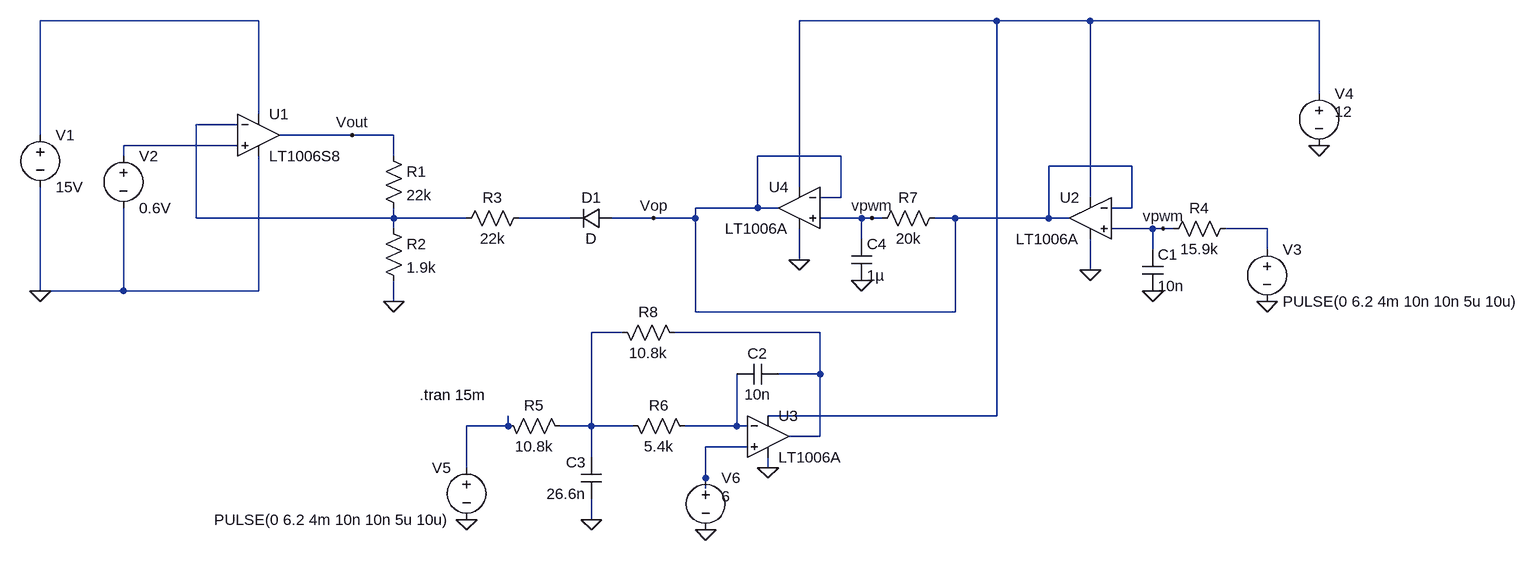
[diagram p0: schematic TPS56x21_buck_adjustable.asc]
TPS56x21_buck_adjustable.asc, the LTspice schematic file:
Version 4
SHEET 1 1580 784
WIRE -416 -32 -752 -32
WIRE 720 -32 416 -32
WIRE 864 -32 720 -32
WIRE 1216 -32 864 -32
WIRE 1216 80 1216 -32
WIRE -416 112 -416 -32
WIRE -448 128 -512 128
WIRE -752 144 -752 -32
WIRE -272 144 -384 144
WIRE -208 144 -272 144
WIRE -448 160 -624 160
WIRE -624 176 -624 160
WIRE -208 176 -208 144
WIRE 480 176 352 176
WIRE 928 192 800 192
WIRE 416 224 416 -32
WIRE 480 240 480 176
WIRE 480 240 448 240
WIRE 864 240 864 -32
WIRE 352 256 352 176
WIRE 352 256 256 256
WIRE 384 256 352 256
WIRE 928 256 928 192
WIRE 928 256 896 256
WIRE -512 272 -512 128
WIRE -208 272 -208 256
WIRE -208 272 -512 272
WIRE -96 272 -208 272
WIRE 64 272 -16 272
WIRE 192 272 128 272
WIRE 256 272 256 256
WIRE 256 272 192 272
WIRE 512 272 448 272
WIRE 528 272 512 272
WIRE 544 272 528 272
WIRE 656 272 624 272
WIRE 800 272 800 192
WIRE 800 272 656 272
WIRE 832 272 800 272
WIRE -208 288 -208 272
WIRE 960 288 896 288
WIRE 976 288 960 288
WIRE 992 288 976 288
WIRE 1136 288 1072 288
WIRE 512 304 512 272
WIRE 960 320 960 288
WIRE 1136 320 1136 288
WIRE 416 336 416 288
WIRE 864 352 864 304
WIRE -752 384 -752 224
WIRE -624 384 -624 256
WIRE -624 384 -752 384
WIRE -416 384 -416 176
WIRE -416 384 -624 384
WIRE -208 400 -208 368
WIRE 256 416 256 272
WIRE 656 416 656 272
WIRE 656 416 256 416
WIRE 144 448 96 448
WIRE 448 448 224 448
WIRE 448 512 448 448
WIRE 448 512 384 512
WIRE 720 576 720 -32
WIRE 720 576 368 576
WIRE -32 592 -32 576
WIRE -32 592 -96 592
WIRE 96 592 96 448
WIRE 96 592 48 592
WIRE 160 592 96 592
WIRE 320 592 320 512
WIRE 320 592 240 592
WIRE 336 592 320 592
WIRE 448 608 448 512
WIRE 448 608 400 608
WIRE 336 624 272 624
WIRE 96 640 96 592
WIRE -96 656 -96 592
WIRE 368 656 368 640
WIRE 272 672 272 624
WIRE 272 688 272 672
WIRE 96 736 96 704
FLAG -208 400 0
FLAG -752 384 0
FLAG 1136 400 0
FLAG -272 144 Vout
FLAG 864 352 0
FLAG 960 384 0
FLAG 976 288 vpwm
FLAG 192 272 Vop
FLAG 1216 160 0
FLAG -96 736 0
FLAG 368 656 0
FLAG 96 736 0
FLAG 416 336 0
FLAG 512 368 0
FLAG 528 272 vpwm
FLAG 272 752 0
SYMBOL voltage -752 128 R0
WINDOW 123 0 0 Left 2
WINDOW 39 0 0 Left 2
SYMATTR InstName V1
SYMATTR Value 15V
SYMBOL res -224 160 R0
SYMATTR InstName R1
SYMATTR Value 22k
SYMBOL res -224 272 R0
SYMATTR InstName R2
SYMATTR Value 1.9k
SYMBOL Opamps\\LT1006S8 -416 80 R0
SYMATTR InstName U1
SYMBOL voltage -624 160 R0
WINDOW 123 0 0 Left 2
WINDOW 39 0 0 Left 2
SYMATTR InstName V2
SYMATTR Value 0.6V
SYMBOL voltage 1136 304 R0
WINDOW 123 0 0 Left 2
WINDOW 39 0 0 Left 2
SYMATTR InstName V3
SYMATTR Value PULSE(0 6.2 4m 10n 10n 5u 10u)
SYMBOL res 0 256 R90
WINDOW 0 0 56 VBottom 2
WINDOW 3 32 56 VTop 2
SYMATTR InstName R3
SYMATTR Value 22k
SYMBOL diode 128 256 R90
WINDOW 0 0 32 VBottom 2
WINDOW 3 32 32 VTop 2
SYMATTR InstName D1
SYMBOL Opamps\\LT1006A 864 208 M0
SYMATTR InstName U2
SYMBOL cap 944 320 R0
SYMATTR InstName C1
SYMATTR Value 10n
SYMBOL res 1088 272 R90
WINDOW 0 0 56 VBottom 2
WINDOW 3 32 56 VTop 2
SYMATTR InstName R4
SYMATTR Value 15.9k
SYMBOL voltage 1216 64 R0
WINDOW 123 0 0 Left 2
WINDOW 39 0 0 Left 2
WINDOW 3 24 44 Left 2
SYMATTR Value 12
SYMATTR InstName V4
SYMBOL voltage -96 640 M0
WINDOW 123 0 0 Left 2
WINDOW 39 0 0 Left 2
SYMATTR InstName V5
SYMATTR Value PULSE(0 6.2 4m 10n 10n 5u 10u)
SYMBOL Opamps\\LT1006A 368 544 R0
SYMATTR InstName U3
SYMBOL cap 320 496 M90
WINDOW 0 0 32 VBottom 2
WINDOW 3 32 32 VTop 2
SYMATTR InstName C2
SYMATTR Value 10n
SYMBOL res -48 576 M90
WINDOW 0 0 56 VBottom 2
WINDOW 3 32 56 VTop 2
SYMATTR InstName R5
SYMATTR Value 10.8k
SYMBOL res 144 576 M90
WINDOW 0 0 56 VBottom 2
WINDOW 3 32 56 VTop 2
SYMATTR InstName R6
SYMATTR Value 5.4k
SYMBOL cap 112 640 M0
SYMATTR InstName C3
SYMATTR Value 26.6n
SYMBOL Opamps\\LT1006A 416 192 M0
SYMATTR InstName U4
SYMBOL cap 496 304 R0
SYMATTR InstName C4
SYMATTR Value 1µ
SYMBOL res 640 256 R90
WINDOW 0 0 56 VBottom 2
WINDOW 3 32 56 VTop 2
SYMATTR InstName R7
SYMATTR Value 20k
SYMBOL res 128 432 M90
WINDOW 0 0 56 VBottom 2
WINDOW 3 32 56 VTop 2
SYMATTR InstName R8
SYMATTR Value 10.8k
SYMBOL voltage 272 656 R0
WINDOW 123 0 0 Left 2
WINDOW 39 0 0 Left 2
WINDOW 3 24 44 Left 2
SYMATTR Value 6
SYMATTR InstName V6
TEXT -168 544 Left 2 !.tran 15m

The netlist it stands for:
* TPS56x21_buck_adjustable.asc
V1 N001 0 15V
R1 Vout N003 22k
R2 N003 0 1.9k
XU1 N004 N003 N001 0 Vout LT1006S8  ; pins In+ In- V+ V- OUT
V2 N004 0 0.6V
V3 N006 0 PULSE(0 6.2 4m 10n 10n 5u 10u)
R3 N005 N003 22k
D1 Vop N005 D
XU2 vpwm Vop N002 0 Vop LT1006A  ; pins In+ In- V+ V- OUT
C1 vpwm 0 10n
R4 N006 vpwm 15.9k
V4 N002 0 12
V5 N009 0 PULSE(0 6.2 4m 10n 10n 5u 10u)
XU3 N011 N010 N002 0 N008 LT1006A  ; pins In+ In- V+ V- OUT
C2 N010 N008 10n
R5 N009 N007 10.8k
R6 N007 N010 5.4k
C3 N007 0 26.6n
XU4 vpwm Vop N002 0 Vop LT1006A  ; pins In+ In- V+ V- OUT
C4 vpwm 0 1µ
R7 Vop vpwm 20k
R8 N007 N008 10.8k
V6 N011 0 6
.model D D
.lib standard.dio
.tran 15m
.backanno
.end